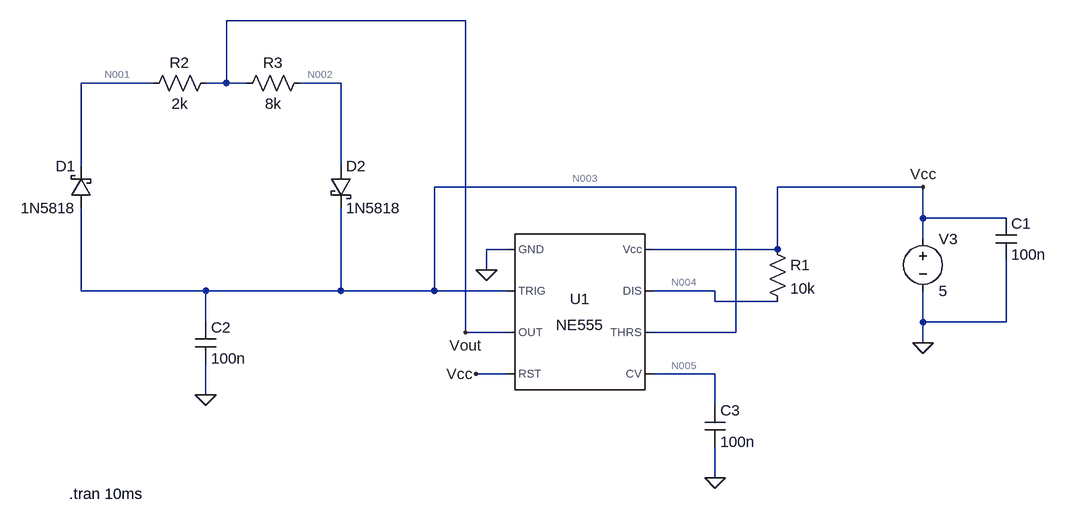
[diagram p0: schematic PWM_555_timer_simulation.asc]
PWM_555_timer_simulation.asc, the LTspice schematic file:
Version 4
SHEET 1 936 680
WIRE 32 -160 -336 -160
WIRE -448 -64 -560 -64
WIRE -336 -64 -336 -160
WIRE -336 -64 -368 -64
WIRE -304 -64 -336 -64
WIRE -160 -64 -224 -64
WIRE -560 64 -560 -64
WIRE -160 64 -160 -64
WIRE 448 96 -16 96
WIRE 736 96 512 96
WIRE 736 144 736 96
WIRE 864 144 736 144
WIRE 736 176 736 144
WIRE 96 192 64 192
WIRE 512 192 512 96
WIRE 512 192 320 192
WIRE 64 224 64 192
WIRE -560 256 -560 128
WIRE -368 256 -560 256
WIRE -160 256 -160 128
WIRE -160 256 -368 256
WIRE -16 256 -16 96
WIRE -16 256 -160 256
WIRE 96 256 -16 256
WIRE 416 256 320 256
WIRE 416 272 416 256
WIRE 512 272 416 272
WIRE -368 304 -368 256
WIRE 736 304 736 256
WIRE 864 304 864 208
WIRE 864 304 736 304
WIRE 32 320 32 -160
WIRE 96 320 32 320
WIRE 448 320 448 96
WIRE 448 320 320 320
WIRE 736 336 736 304
WIRE 96 384 48 384
WIRE 416 384 320 384
WIRE -368 416 -368 368
WIRE 416 432 416 384
WIRE 416 544 416 496
FLAG 64 224 0
FLAG 736 336 0
FLAG 736 96 Vcc
FLAG 48 384 Vcc
FLAG 416 544 0
FLAG 32 320 Vout
FLAG -368 416 0
SYMBOL Misc\\NE555 208 288 R0
SYMATTR InstName U1
SYMBOL voltage 736 160 R0
WINDOW 123 0 0 Left 0
WINDOW 39 0 0 Left 0
SYMATTR InstName V3
SYMATTR Value 5
SYMBOL res -352 -80 R90
WINDOW 0 0 56 VBottom 2
WINDOW 3 32 56 VTop 2
SYMATTR InstName R2
SYMATTR Value 2k
SYMBOL res -208 -80 R90
WINDOW 0 0 56 VBottom 2
WINDOW 3 32 56 VTop 2
SYMATTR InstName R3
SYMATTR Value 8k
SYMBOL schottky -544 128 R180
WINDOW 0 24 64 Left 2
WINDOW 3 24 0 Left 2
SYMATTR InstName D1
SYMATTR Value 1N5818
SYMATTR Description Diode
SYMATTR Type diode
SYMBOL schottky -176 64 R0
SYMATTR InstName D2
SYMATTR Value 1N5818
SYMATTR Description Diode
SYMATTR Type diode
SYMBOL cap -384 304 R0
SYMATTR InstName C2
SYMATTR Value 100n
SYMBOL cap 400 432 R0
SYMATTR InstName C3
SYMATTR Value 100n
SYMBOL res 496 176 R0
SYMATTR InstName R1
SYMATTR Value 10k
SYMBOL cap 848 144 R0
SYMATTR InstName C1
SYMATTR Value 100n
TEXT -578 568 Left 2 !.tran 10ms

The netlist it stands for:
* PWM_555_timer_simulation.asc
XU1 0 N003 Vout Vcc N005 N003 N004 Vcc NE555  ; pins GND TRIG OUT RST CV THRS DIS Vcc
V3 Vcc 0 5
R2 Vout N001 2k
R3 N002 Vout 8k
D1 N003 N001 1N5818
D2 N002 N003 1N5818
C2 N003 0 100n
C3 N005 0 100n
R1 Vcc N004 10k
C1 Vcc 0 100n
.model D D
.lib standard.dio
.tran 10ms
.lib NE555.sub
.backanno
.end

* Results of the author's LTspice run, read from the files saved beside the schematic
* Operating Point, zero values left out:
*   V(n003) = 5 V
*   V(n005) = 3.333 V
*   V(vcc) = 5 V
*   V(n004) = 5 V
*   V(vout) = 5 V
*   V(n001) = 5 V
*   V(n002) = 5 V
*   I(D2) = 2.549 nA
*   I(D1) = -7.451 nA
*   I(R1) = 6.672 nA
*   I(R3) = -2.549 nA
*   I(R2) = 7.451 nA
*   I(V3) = -1.611 mA
*   Ix(u1:1) = -1.611 mA
*   Ix(u1:2) = 5 nA
*   Ix(u1:3) = -10 nA
*   Ix(u1:4) = 22.67 µA
*   Ix(u1:6) = 5 nA
*   Ix(u1:7) = 6.672 nA
*   Ix(u1:8) = 1.588 mA
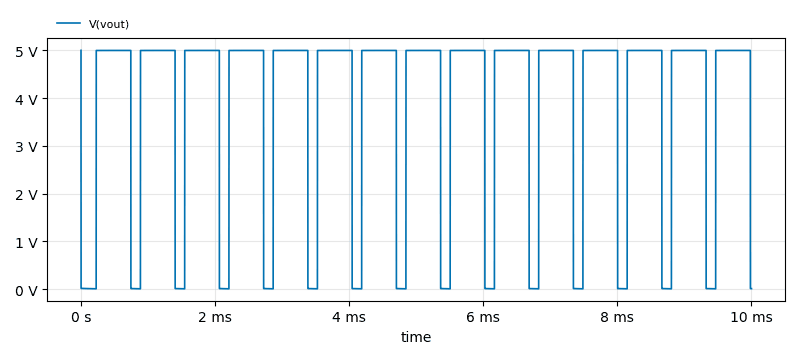
[diagram p1: Transient Analysis of PWM_555_timer_simulation.asc, plotted from the saved traces]
* Transient Analysis, 1 run:
*   V(vout): min 4.851 mV, max 5 V, average 3.877 V, rms 4.401 V, last 8.962 mV